# Altium schematic sheet ActiveRectifier_IR1167.SchDoc: Active rectifier
size A4; Engineer: Pavel Nadein
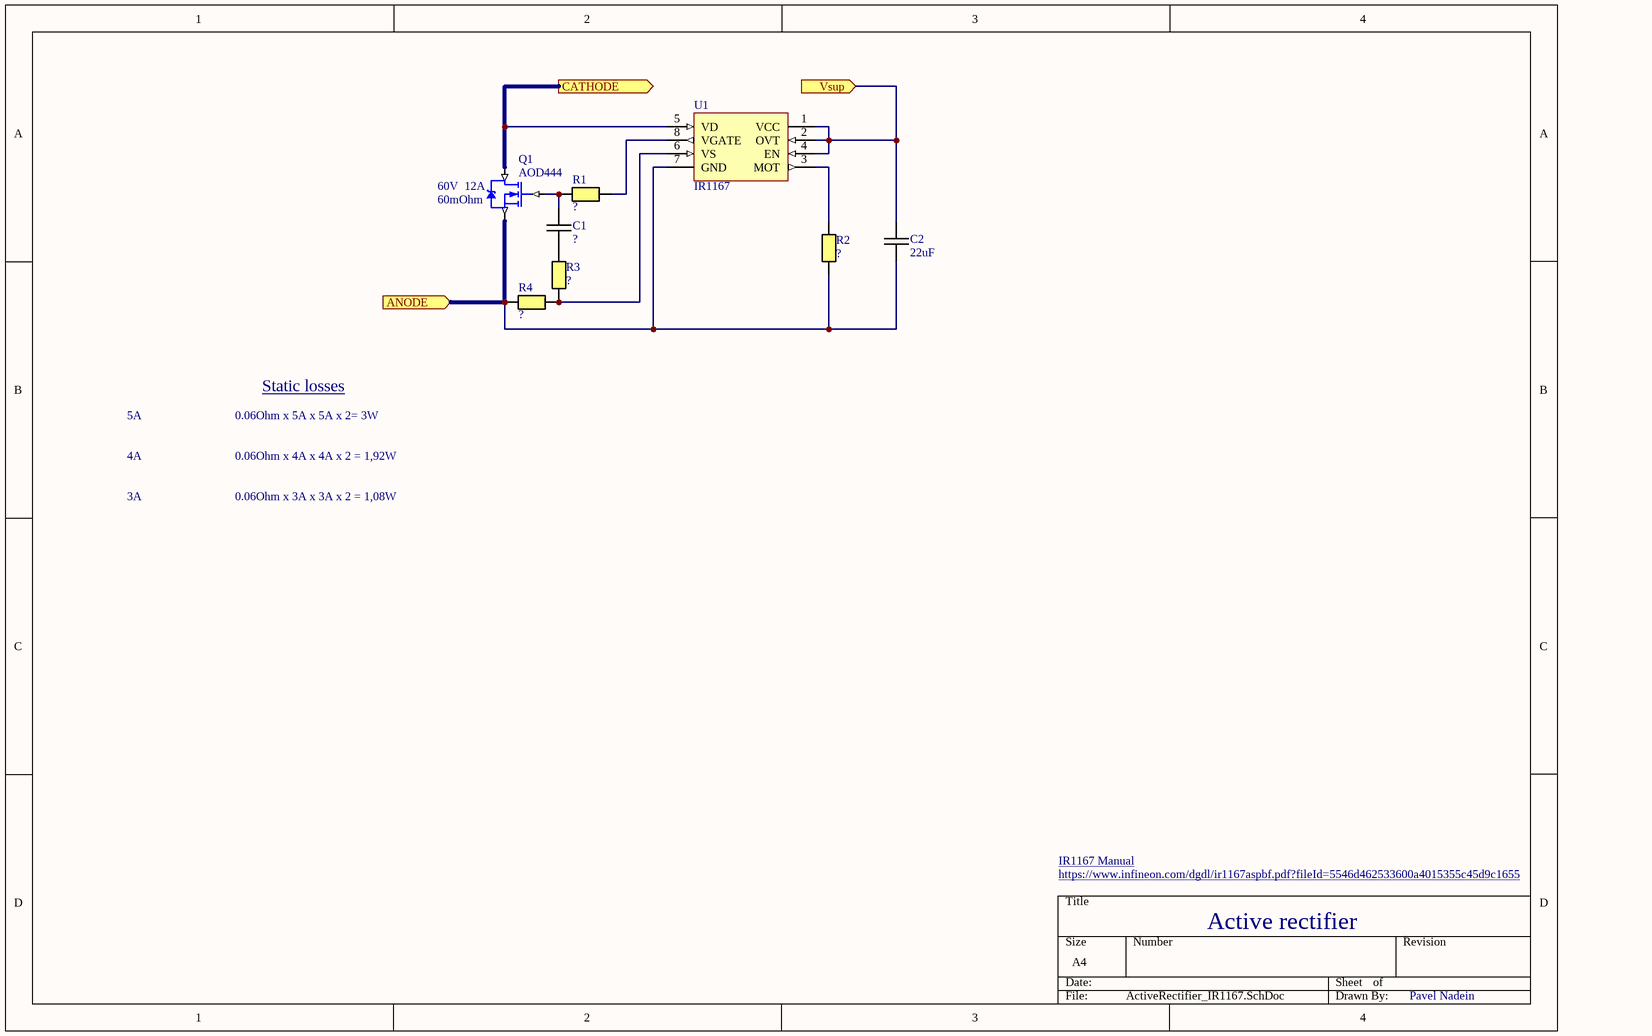
[diagram p0: ActiveRectifier_IR1167.SchDoc]

## Parts
C1  ?  [CAPC0603(1608)55_N]
C2  22uF  [CAPC0805(2012)75_N]
Q1  AOD444  Vds: 60V  Id: 12A  Rds: 60mOhm  [TO-252]
R1  ?  [RESC0603(1608)_N]
R2  ?  [RESC0603(1608)_N]
R3  ?  [RESC0603(1608)_N]
R4  ?  [RESC0603(1608)_N]
U1  IR1167  [SOIC8_N]

## Ports
ANODE (in), CATHODE (out), Vsup (in)

## Nets
ANODE: C2.2 Q1.3(S) R2.1 R4.1 U1.7(GND) ; port ANODE
CATHODE: Q1.4(D) U1.5(VD) ; port CATHODE
Vsup: C2.1 U1.1(VCC) U1.2(OVT) U1.4(EN) ; port Vsup
NetC1_1: C1.1 Q1.1(G) R1.1
NetC1_2: C1.2 R3.1
NetR1_2: R1.2 U1.8(VGATE)
NetR2_2: R2.2 U1.3(MOT)
NetR3_2: R3.2 R4.2 U1.6(VS)

## Notes on the sheet
- 5A
- 0.06Ohm x 5A x 5A x 2= 3W
- Static losses
- 4A
- 3A
- 0.06Ohm x 4A x 4A x 2 = 1,92W
- 0.06Ohm x 3A x 3A x 2 = 1,08W
- IR1167 Manual
- https://www.infineon.com/dgdl/ir1167aspbf.pdf?fileId=5546d462533600a4015355c45d9c1655

## Library data of the parts
C1 C2 = Capacitor M: Ceramic capacitor Medium density
  C1: Value: ?
  C2: Value: 22uF
Q1 = AOD444: HEXFET Power MOSFET; Ciss: 450pF
R1-R4 = Resistor M: Resistor Medium Density; Value: ?
U1 = IR1167: Secondary side high speed SR controller; Vd: 200V; Vout IR1167A: 10.7V; Vout IR1167B: 14.5V; Io: +2A / -7A; Turn on Propagation  Delay: 60ns; Turn off Propagation  Delay: 40ns